# Altium schematic sheet Actuation.SchDoc
size A4
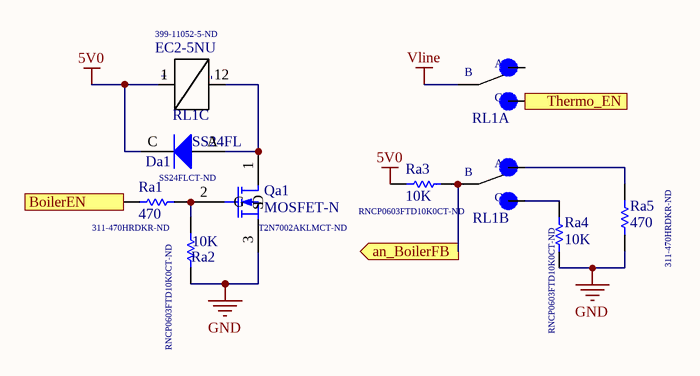
[diagram p0: Actuation.SchDoc]

## Parts
Da1  SS24FL  Supplier Part Number 1: SS24FLCT-ND  [SOD123F]
Qa1  MOSFET-N  Supplier Part Number 1: T2N7002AKLMCT-ND  [SOT23]
Ra1  value 470  Supplier Part Number 1: 311-470HRDKR-ND  [r0603]  (hidden comment: Res1)
Ra2  value 10K  Supplier Part Number 1: RNCP0603FTD10K0CT-ND  [r0603]  (hidden comment: Res1)
Ra3  value 10K  Supplier Part Number 1: RNCP0603FTD10K0CT-ND  [r0603]  (hidden comment: Res1)
Ra4  value 10K  Supplier Part Number 1: RNCP0603FTD10K0CT-ND  [r0603]  (hidden comment: Res1)
Ra5  value 470  Supplier Part Number 1: 311-470HRDKR-ND  [r0603]  (hidden comment: Res1)
RL1  EC2-5NU  [REL_EC2-5NU]  (value not drawn)  (parts A,B,C of 3)

## Ports
an_BoilerFB (out), BoilerEN (in), Thermo_EN

## Nets
5V0: Da1.C(K) Ra3.2 RL1.1(POS)
GND: Qa1.3(S) Ra2.1 Ra4.2 Ra5.2
Vline: RL1.4(B1)
an_BoilerFB: Ra3.1 RL1.9(B) ; port an_BoilerFB
BoilerEN: Ra1.2 ; port BoilerEN
Thermo_EN: RL1.5(C1) ; port Thermo_EN
NetDa1_A: Da1.A Qa1.1(D) RL1.12(NEG)
NetQa1_2: Qa1.2(G) Ra1.1 Ra2.2
NetRa4_1: Ra4.1 RL1.8(C)
NetRa5_1: Ra5.1 RL1.10(A)

Not connected (* = marked no-connect by the designer): RL1 3(A1)

## Notes on the sheet
- (in symbol EC2-5NU, part A) A; B; C
- (in symbol EC2-5NU, part C) +; -

## Library data of the parts
Da1 = Diode: Default Diode; Published: 8-Jun-2000; LatestRevisionDate: 17-Jul-2002; LatestRevisionNote: Re-released for DXP Platform.; PackageVersion: Sep-1996; PackageReference: SMC; Publisher: Altium Limited; PackageDescription: DO-214-AB/SMC; 2 C-Bend Leads; Body 7.9 x 5.9 mm, inc. leads (LxW); Code_JEDEC: DO-214-AB; Supplier 1: Digi-Key
Qa1 = MOSFET-N: N-Channel MOSFET; Published: 8-Jun-2000; LatestRevisionDate: 17-Jul-2002; LatestRevisionNote: Re-released for DXP Platform.; PackageVersion: 1995/1996; PackageReference: E3; Publisher: Altium Limited; PackageDescription: TO, Flat Index; 3 In-Line, Axial Leads; Body Dia. 4.6mm; Lead Dia. 0.5 mm (max); Supplier 1: Digi-Key
Ra1-Ra5 = Res1: Resistor; Published: 8-Jun-2000; LatestRevisionDate: 17-Jul-2002; LatestRevisionNote: Re-released for DXP Platform.; PackageReference: AXIAL-0.3; Publisher: Altium Limited; PackageDescription: Axial Device, Thru-Hole; 2 Leads; 0.3 in Pin Spacing; Supplier 1: Digi-Key
RL1 = EC2-5NU: Electromechanical Relay DPDT 2A 5VDC 178Ohm Through Hole; MF: KEMET; Price: None; MP: EC2-5NU; Package: None; Availability: Unavailable; SnapEDA_Link: https://www.snapeda.com/parts/EC2-5NU/KEMET/view-part/?ref=snap; Value: *